# EAGLE design LNA (EAGLE 6.5.0)
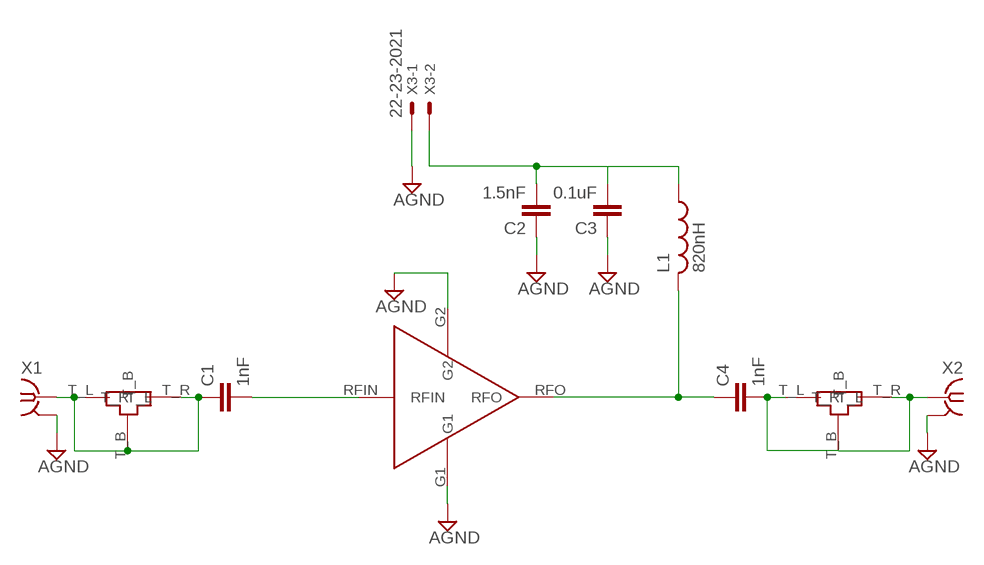
[diagram p0: schematic, sheet 1]

## Parts
C1  1nF  C-EUC0603  [C0603]
C2  1.5nF  C-EUC0603  [C0603]
C3  0.1uF  C-EUC0603  [C0603]
C4  1nF  C-EUC0603  [C0603]
IN1  TEE_TL1  [TEE_TL1]
L1  820nH  L-USL3230M  [L3230M]
OUT2  TEE_TL1  [TEE_TL1]
U$1  PSA4-5043+  [PSA4-5043+]
X1  SMA-142-0711-821/826  [J502-ND-142-0711-821/826]
X2  SMA-142-0711-821/826  [J502-ND-142-0711-821/826]
X3  22-23-2021  [22-23-2021]

## Nets
AGND: C2.1 C3.1 U$1.G1 U$1.G2 X1.G@1 X1.G@2 X1.G@3 X1.G@4 X2.G@1 X2.G@2 X2.G@3 X2.G@4 X3.1
EIP: C2.2 C3.2 L1.1 X3.2
IN: C1.2 U$1.RFIN
IN1: C1.1 IN1.T_B IN1.T_L IN1.T_R X1.1
OUT: C4.1 L1.2 U$1.RFO
OUT2: C4.2 OUT2.T_B OUT2.T_L OUT2.T_R X2.1

## Library data of the parts
C1-C4 = rcl:C-EU: CAPACITOR, European symbol
IN1 OUT2 = ECE532_Parts:TEE_TL1
L1 = resistor:L-US: INDUCTOR, American symbol
U$1 = ECE532_Parts:PSA4-5043+
X1 X2 = con-coax:SMA-: SMA 50 Ohm End Launch Jack Receptacle - Round Contact Johnson Components Source: www.johnsoncomponents.com .. J502-ND.pdf; MF: JOHNSON COMPONENTS; MPN: 142-0711-821; OC_FARNELL: 1019328; OC_NEWARK: 16F3627
X3 = con-molex:22-23-2021: .100" (2.54mm) Center Header - 2 Pin; MF: MOLEX; MPN: 22-23-2021; OC_FARNELL: 1462926; OC_NEWARK: 25C3832

## Board
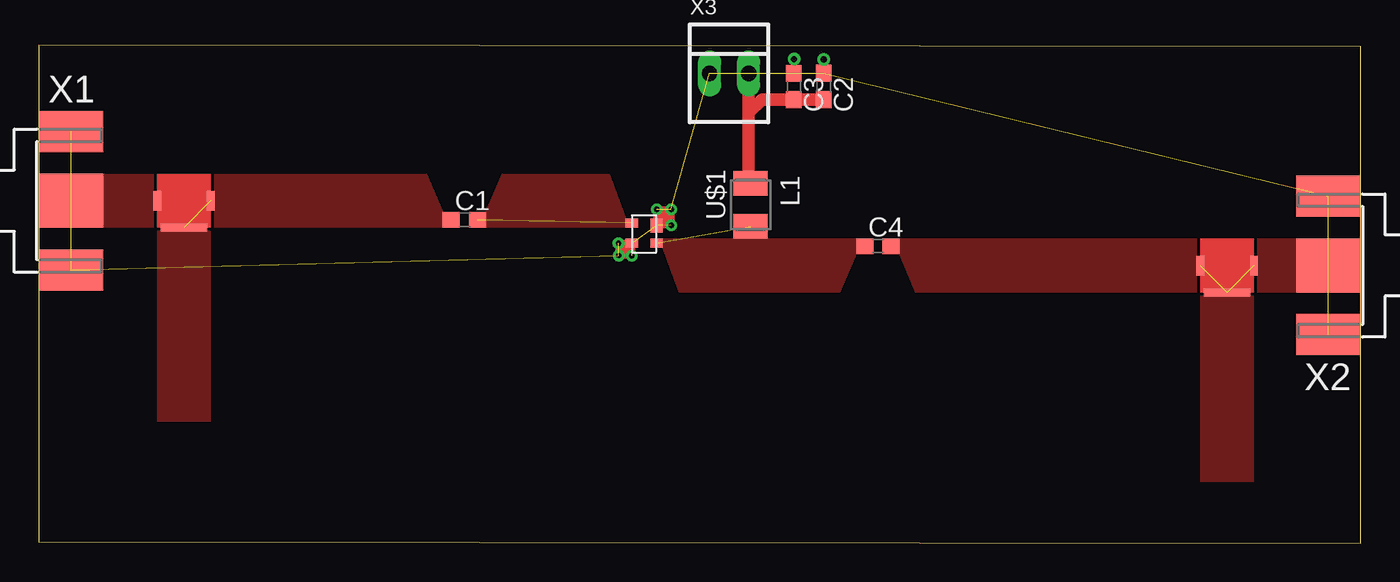
[diagram p1: board, top side]
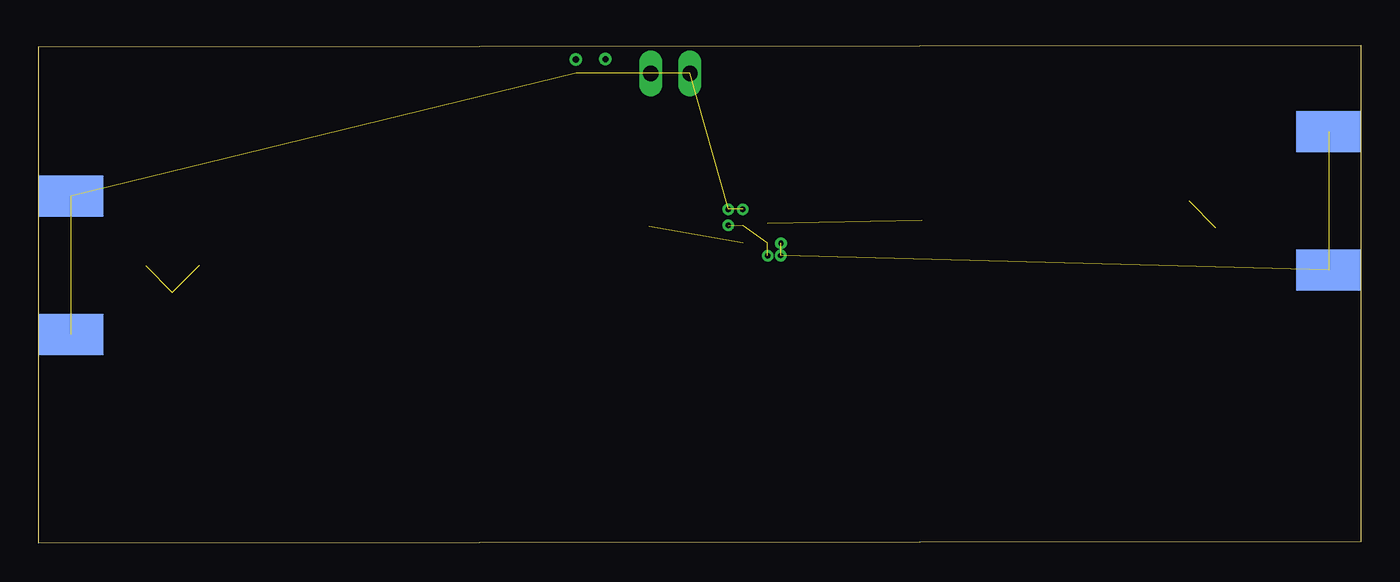
[diagram p2: board, bottom side, seen from below]

Size 85.84 x 32.35 mm. Coordinates in mm from the lower left corner, seen from the top.
Outline: 0,0.1 85.84,0 85.84,32.25 0,32.35 0,0.1
Copper layers (1*16): Top 0.035mm / dielectric 1.5mm / Bottom 0.035mm
Design rules "default": minimum track width 10mil, minimum drill 24mil, track to track 8mil, track to pad 8mil, pad to pad 8mil, via to via 8mil, smd to smd 8mil, copper to edge 40mil, drill to drill 8mil, minimum pad ring 10mil, minimum via ring 8mil, stop-mask expansion 4mil, vias tented up to drill 0mil, thermal gap 10mil

### Footprints (pad centres in the part's own frame; a part is rotated, then mirrored left to right if it is on the bottom)
C0603 = smd 1.1 x 1: 1 -0.85,0; 2 0.85,0
TEE_TL1 = smd 3 x 0.5: T_B 0,-0.475 | smd 0.5 x 1.27: T_L -1.745,1.27; T_R 1.745,1.27
L3230M = smd 1.6 x 2.2: 1 -1.4,0; 2 1.4,0
PSA4-5043+ = smd 0.9 x 0.8: G1 0.15,0.33 | smd 0.6 x 0.8: G2 1.3,-1.27; RFIN 0,-1.27; RFO 1.3,0.33
J502-ND-142-0711-821/826 = smd 4.191 x 3.49: 1 2.115,0 | smd 4.191 x 2.667: G@1 2.115,4.495; G@2 2.115,-4.495 | smd 4.191 x 2.667 bottom: G@3 2.115,4.495; G@4 2.115,-4.495
22-23-2021 = drill 1 long: 1 -1.27,0; 2 1.27,0

### Placement (x,y rotation side)
C1  27.64,21 0 top
C2  50.96,29.66 270 top
C3  49.02,29.66 270 top
C4  54.48,19.28 0 top
IN1  9.44,20.97 0 top
L1  46.22,21.98 270 top
OUT2  77.15,16.76 0 top
U$1  39.78,20.79 270 top
X1  -0.01,22.25 0 top
X2  85.84,18.04 180 top
X3  44.82,30.52 0 top

### Tracks (layer width: path | path; a pad name or v marks a point on that pad's centre or on a via)
AGND  (via drill 0.35, 0.4)  (16 unrouted)
  Top 0.406: U$1.G1 40.13,20.66 v40.13,21.69 | v38.51,18.67 | C3.1 49.04,30.51 v49.04,31.44 | C2.1 v50.96,31.42 | U$1.G2 v37.66,19.49 v37.65,19.48
  other vias: 37.66,18.68 41.07,20.64 41.06,21.69
EIP
  Top 0.406: C3.2 | 46.09,23.51 L1.1
  Top 0.8: C3.2 C2.2 | X3.2 46.09,27.95 | 46.09,27.95 46.09,23.51 | C3.2 46.95,28.81 46.09,27.95
IN  (1 unrouted)
  pour Top (no thermals): 37.06,23.99 37.06,20.5 38.12,20.5 38.13,21.09
  pour Top (no thermals): 30.09,23.99 30.09,20.5 29.03,20.5 29.03,21.5
IN1  (1 unrouted)
  pour Top (no thermals): 11.19,23.99 25.19,23.99 25.19,20.5 11.19,20.5
  pour Top (no thermals): 25.19,23.99 25.19,20.5 26.25,20.5 26.25,21.49
  pour Top (no thermals): 7.69,20.5 11.18,20.5 11.18,7.9 7.69,7.9
  pour Top (no thermals): 4.11,23.98 7.7,23.98 7.7,20.49 4.11,20.49
N$1
  Top 0.406: 37.66,19.49 37.66,18.7 38.5,18.7 38.5,18.69 38.53,18.69 38.53,19.47
N$3
  Top 0.406: 40.16,21.67 41.07,21.67 41.07,21.66 41.08,21.66 41.08,20.65 40.18,20.65 40.18,20.68
N$4
  Top 0.406: 40.39,21.45 40.84,21.45 40.84,20.93 40.52,20.93 40.58,20.93 40.58,21.15 40.41,21.15
N$5
  Top 0.406: 37.92,19.3 38.2,19.3 38.2,18.98 37.96,18.98 37.96,18.99
OUT  (1 unrouted)
  pour Top (no thermals): 41.56,16.3 41.56,19.79 40.5,19.79 40.5,19.19
  pour Top (no thermals): 52.03,16.29 52.03,19.78 53.09,19.78 53.1,18.79
  pour Top (no thermals): 41.57,19.79 41.57,16.3 52.04,16.3 52.04,19.79
OUT2  (2 unrouted)
  pour Top (no thermals): 56.92,19.78 75.42,19.78 75.42,16.29 56.92,16.29
  pour Top (no thermals): 56.93,16.29 56.93,19.78 55.87,19.78 55.87,18.79
  pour Top (no thermals): 78.87,19.78 82.36,19.78 82.36,16.29 78.87,16.29
  pour Top (no thermals): 75.41,16.29 78.9,16.29 78.9,3.99 75.41,3.99
XX
  pour Top (no thermals): 30.09,23.99 30.09,20.5 37.07,20.5 37.07,23.99